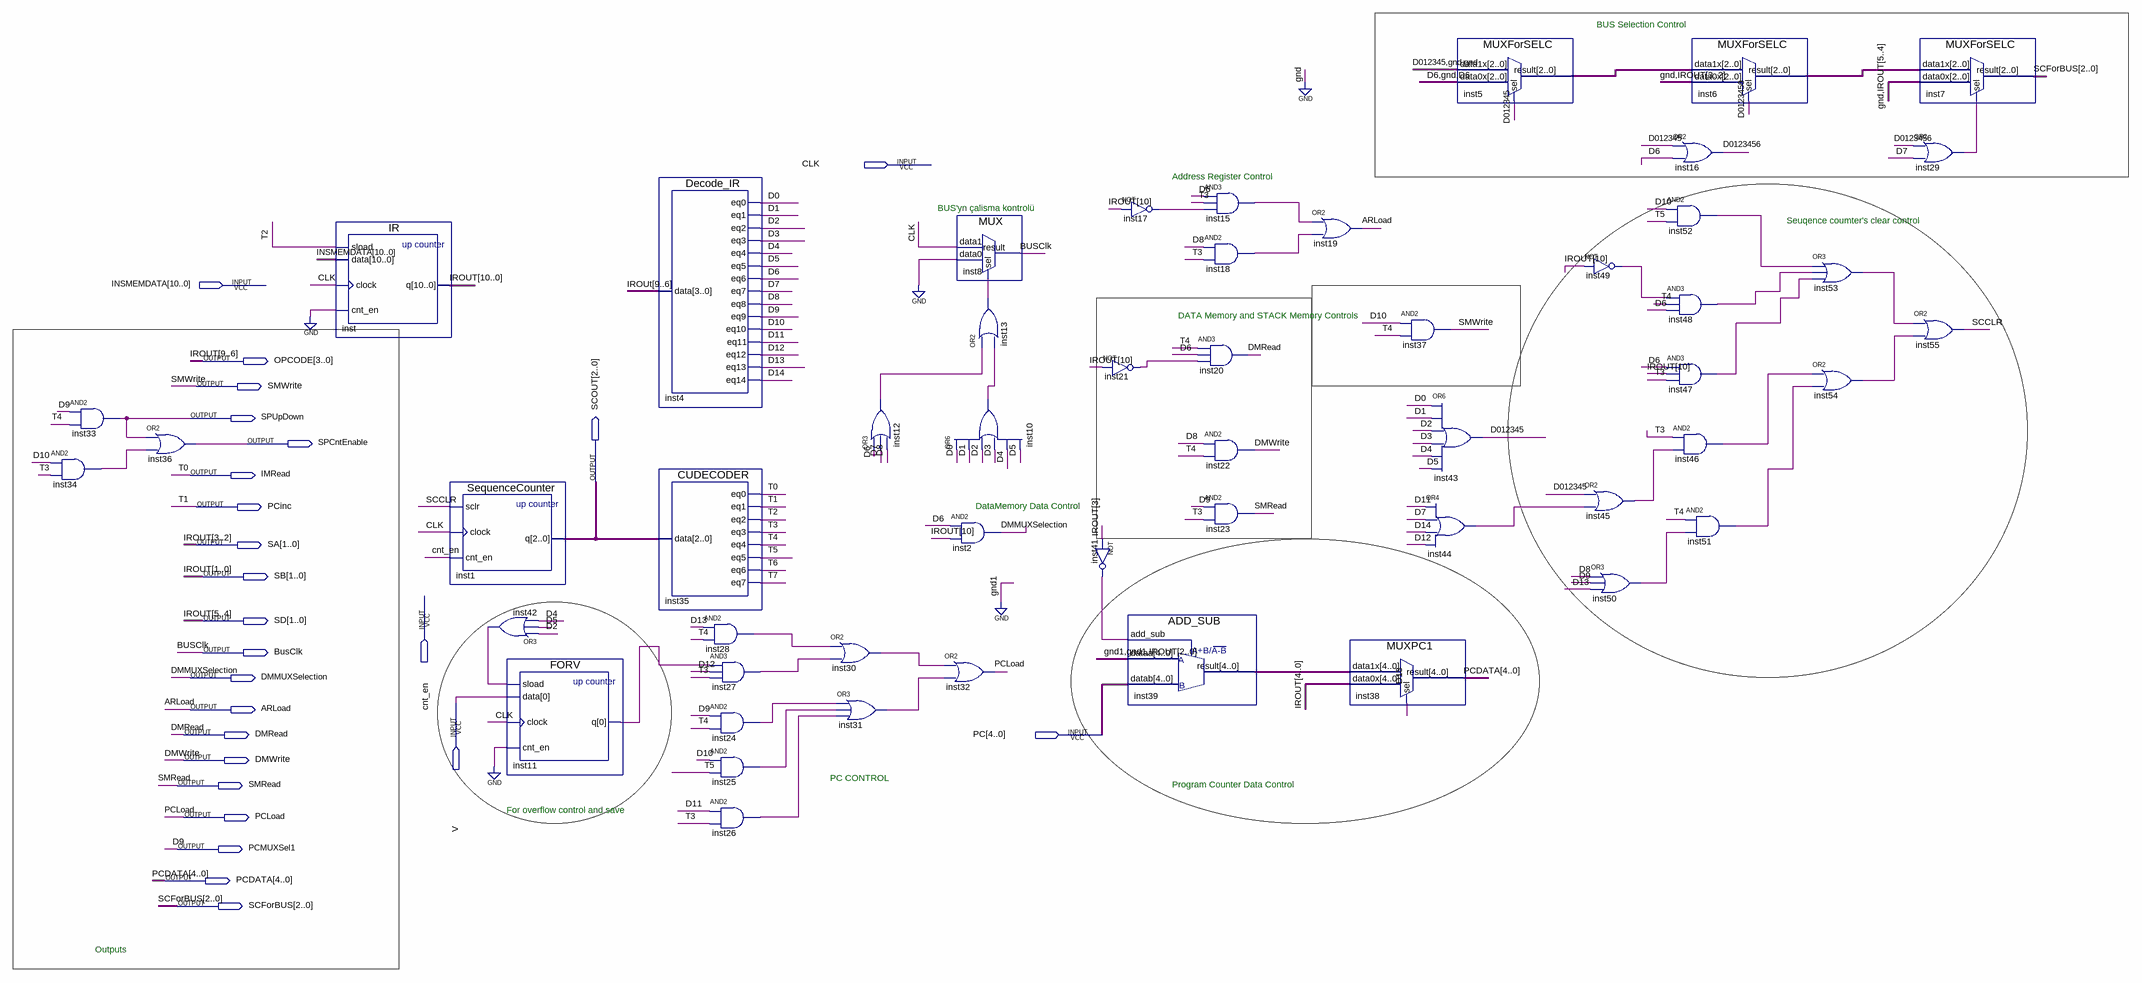
[diagram p0: schematic sheet]
// Quartus schematic Control_Unit_2017510082_Nilay_Yucel_1.bdf as structural Verilog: 52 symbols, 25 pins
module Control_Unit_2017510082_Nilay_Yucel_1 (
  input  CLK,
  input  [10:0] INSMEMDATA,
  input  cnt_en,
  input  V,
  input  [4:0] PC,
  output [3:0] OPCODE,
  output SMWrite,
  output SPUpDown,
  output SPCntEnable,
  output IMRead,
  output [2:0] SCOUT,
  output PCinc,
  output [1:0] SA,
  output [1:0] SB,
  output [1:0] SD,
  output BusClk,
  output DMMUXSelection,
  output ARLoad,
  output DMRead,
  output DMWrite,
  output SMRead,
  output PCLoad,
  output PCMUXSel1,
  output [4:0] PCDATA,
  output [2:0] SCForBUS
);

  wire D0, D1, D2, D3, D4, D5, D6, D7, D8, D10, D11, D12, D13, D14, D012345, D0123456, inst10_out, inst11_q,
       inst12_out, inst13_out, inst15_out, inst17_out, inst18_out, inst21_out, inst24_out, inst25_out,
       inst26_out, inst27_out, inst28_out, inst29_out, inst30_out, inst31_out, inst34_out, inst41_out,
       inst42_out, inst44_out, inst45_out, inst46_out, inst47_out, inst48_out, inst49_out, inst50_out,
       inst51_out, inst52_out, inst53_out, inst54_out, SCCLR, T2, T3, T4, T5, T6, T7;
  wire [2:0] inst5_result, inst6_result;
  wire [4:0] inst39_result;
  wire [10:10] IROUT;

  and inst33 (SPUpDown, PCMUXSel1, T4);
  and inst34 (inst34_out, D10, T3);
  or inst36 (SPCntEnable, SPUpDown, inst34_out);
  IR inst (.sload(T2), .data(INSMEMDATA), .clock(CLK), .cnt_en(1'b0), .q({IROUT[10], OPCODE, SD, SA, SB}));
  SequenceCounter inst1 (.sclr(SCCLR), .clock(CLK), .cnt_en(cnt_en), .q(SCOUT));
  or inst42 (inst42_out, D2, D5, D4);
  FORV inst11 (.sload(inst42_out), .data(V), .clock(CLK), .cnt_en(1'b0), .q(inst11_q));
  Decode_IR inst4 (
    .data(OPCODE), .eq0(D0), .eq1(D1), .eq2(D2), .eq3(D3), .eq4(D4), .eq5(D5), .eq6(D6), .eq7(D7), .eq8(D8),
    .eq9(PCMUXSel1), .eq10(D10), .eq11(D11), .eq12(D12), .eq13(D13), .eq14(D14));
  CUDECODER inst35 (
    .data(SCOUT), .eq0(IMRead), .eq1(PCinc), .eq2(T2), .eq3(T3), .eq4(T4), .eq5(T5), .eq6(T6), .eq7(T7));
  and inst28 (inst28_out, D13, T4);
  and inst27 (inst27_out, inst11_q, D12, T3);
  and inst24 (inst24_out, PCMUXSel1, T4);
  and inst25 (inst25_out, D10, T5);
  and inst26 (inst26_out, D11, T3);
  or inst30 (inst30_out, inst28_out, inst27_out);
  or inst31 (inst31_out, inst24_out, inst25_out, inst26_out);
  or inst12 (inst12_out, D6, D7, D8);
  or inst10 (inst10_out, D0, D1, D2, D3, D4, D5);
  or inst32 (PCLoad, inst30_out, inst31_out);
  MUX inst8 (.data1(CLK), .data0(1'b0), .sel(inst13_out), .result(BusClk));
  or inst13 (inst13_out, inst12_out, inst10_out);
  and inst2 (DMMUXSelection, D6, IROUT[10]);
  not inst41 (inst41_out, SA[1]);
  not inst17 (inst17_out, IROUT[10]);
  not inst21 (inst21_out, IROUT[10]);
  ADD_SUB inst39 (.add_sub(inst41_out), .dataa({2'b00, SA[0], SB}), .datab(PC), .result(inst39_result));
  and inst20 (DMRead, T4, D6, inst21_out);
  and inst15 (inst15_out, D6, T3, inst17_out);
  and inst18 (inst18_out, D8, T3);
  and inst22 (DMWrite, D8, T4);
  and inst23 (SMRead, PCMUXSel1, T3);
  or inst19 (ARLoad, inst15_out, inst18_out);
  MUXPC1 inst38 (.data1x(inst39_result), .data0x({SD[0], SA, SB}), .sel(D13), .result(PCDATA));
  and inst37 (SMWrite, D10, T4);
  or inst43 (D012345, D0, D1, D2, D3, D4, D5);
  or inst44 (inst44_out, D11, D7, D14, D12);
  MUXForSELC inst5 (.data1x({D012345, 2'b00}), .data0x({D6, 1'b0, D6}), .sel(D012345), .result(inst5_result));
  not inst49 (inst49_out, IROUT[10]);
  or inst45 (inst45_out, D012345, inst44_out);
  or inst50 (inst50_out, D8, PCMUXSel1, D13);
  MUXForSELC inst6 (.data1x(inst5_result), .data0x({1'b0, SA}), .sel(D0123456), .result(inst6_result));
  or inst16 (D0123456, D012345, D6);
  and inst52 (inst52_out, D10, T5);
  and inst48 (inst48_out, inst49_out, T4, D6);
  and inst47 (inst47_out, D6, IROUT[10], T3);
  and inst46 (inst46_out, T3, inst45_out);
  and inst51 (inst51_out, T4, inst50_out);
  or inst53 (inst53_out, inst52_out, inst48_out, inst47_out);
  or inst54 (inst54_out, inst46_out, inst51_out);
  MUXForSELC inst7 (.data1x(inst6_result), .data0x({1'b0, SD}), .sel(inst29_out), .result(SCForBUS));
  or inst29 (inst29_out, D0123456, D7);
  or inst55 (SCCLR, inst53_out, inst54_out);

  // Other names for the same wires on the sheet: D9 = PCMUXSel1; IROUT[9:0] = {OPCODE, SD, SA, SB}; T0 = IMRead;
  //   T1 = PCinc

  // Notes on the sheet:
  //   BUS Selection Control
  //   Address Register Control
  //   BUS'yn çalisma kontrolü
  //   Seuqence coumter's clear control
  //   DATA Memory and STACK Memory Controls
  //   DataMemory Data Control
  //   PC CONTROL
  //   Program Counter Data Control
  //   For overflow control and save
  //   Outputs
endmodule
